# EAGLE schematic prototype (EAGLE 6.5.0)
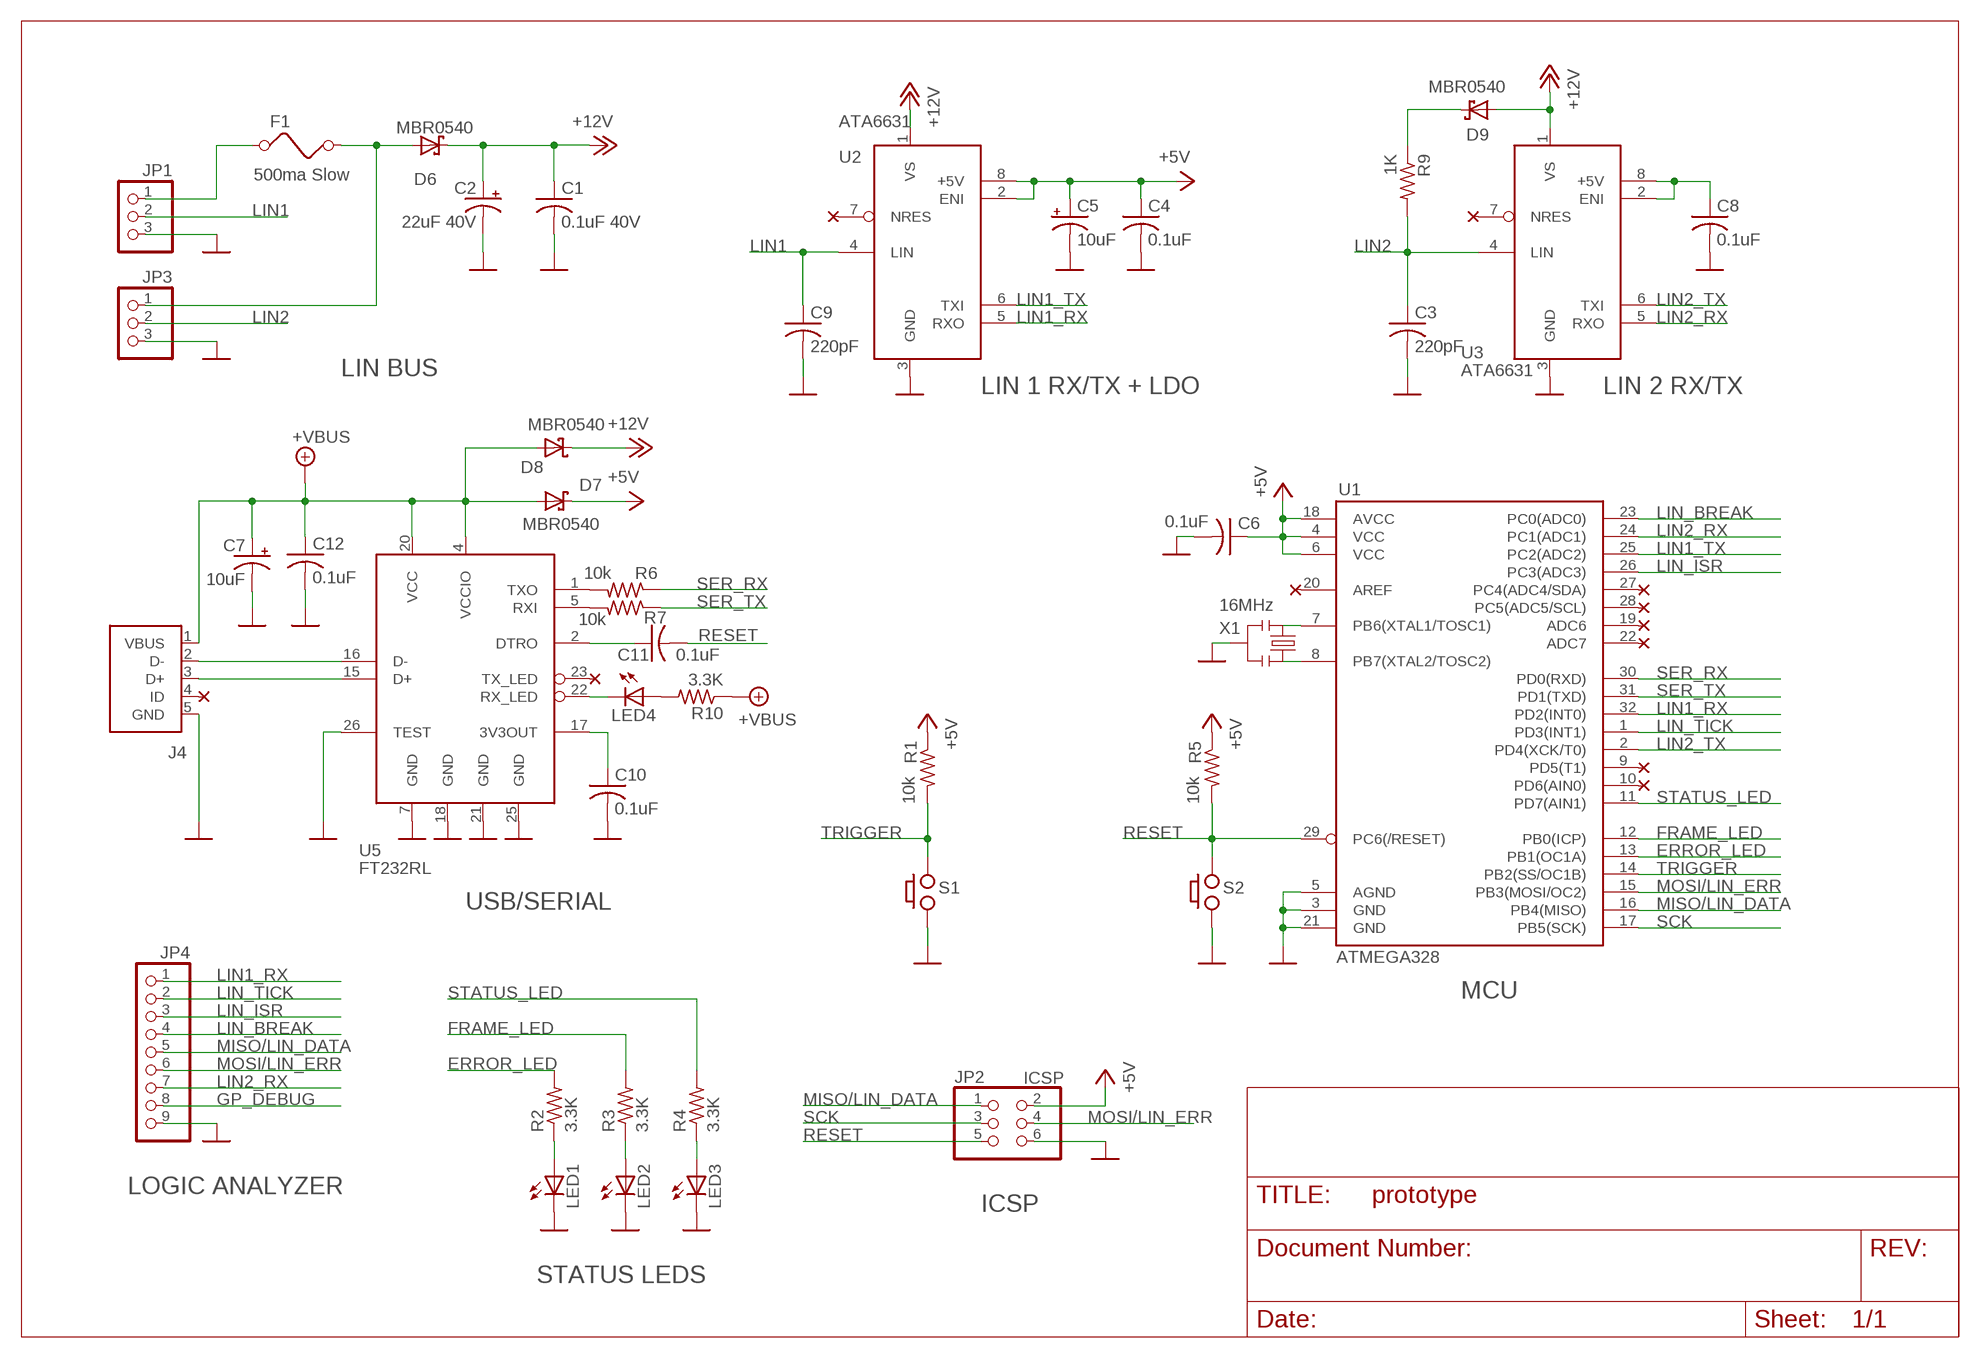
[diagram p0: schematic, sheet 1]

## Parts
C1  0.1uF 40V  C-USC0805  [C0805]
C2  22uF 40V  CPOL-USUD-6,3X5,8  [UD-6,3X5,8_NICHICON]
C3  220pF  C-USC0805  [C0805]
C4  0.1uF  C-USC0805  [C0805]
C5  10uF  CPOL-USA/3216-18R  [A/3216-18R]
C6  0.1uF  C-USC0805  [C0805]
C7  10uF  CPOL-USA/3216-18R  [A/3216-18R]
C8  0.1uF  C-USC0805  [C0805]
C9  220pF  C-USC0805  [C0805]
C10  0.1uF  C-USC0805  [C0805]
C11  0.1uF  C-USC0805  [C0805]
C12  0.1uF  C-USC0805  [C0805]
D6  MBR0540  SMF5.0AT1  [SOD123FL]
D7  MBR0540  SMF5.0AT1  [SOD123FL]
D8  MBR0540  SMF5.0AT1  [SOD123FL]
D9  MBR0540  SMF5.0AT1  [SOD123FL]
F1  500ma Slow  FUSE  [1206]
J4  USBSMD  [USB-MINIB]
JP1  PINHD-1X3  [1X03]
JP2  ICSP  PINHD-2X3  [2X03]
JP3  PINHD-1X3  [1X03]
JP4  PINHD-1X9  [1X09]
LED1  LED  [1206-LED]
LED2  LED  [1206-LED]
LED3  LED  [1206-LED]
LED4  LED  [1206-LED]
R1  10k  R-US_R0805  [R0805]
R2  3.3K  R-US_R0805  [R0805]
R3  3.3K  R-US_R0805  [R0805]
R4  3.3K  R-US_R0805  [R0805]
R5  10k  R-US_R0805  [R0805]
R6  10k  R-US_R0805  [R0805]
R7  10k  R-US_R0805  [R0805]
R9  1K  R-US_R0805  [R0805]
R10  3.3K  R-US_R0805  [R0805]
S1  PUSH_BUTTON  [DUMMY-2]
S2  PUSH_BUTTON  [DUMMY-2]
U1  ATMEGA328  [TQFP32-08]
U2  ATA6631  [SO-08]
U3  ATA6631  [SO-08]
U5  FT232RL  [SSOP28DB]
X1  16MHz  RESONATORSMD  [RESONATOR-SMD]

## Nets
+5V: C4.1 C5.+ C6.1 D7.C JP2.2 R1.1 R5.1 U1.4(VCC) U1.6(VCC) U1.18(AVCC) U2.2(ENI) U2.8(+5V)
+12V: C1.1 C2.+ D6.C D8.C D9.A U2.1(VS) U3.1(VS)
+VBUS: C7.+ C12.1 D7.A D8.A J4.1(VBUS) R10.1 U5.4(VCCIO) U5.20(VCC)
ERROR_LED: R2.2 U1.13(PB1(OC1A))
FRAME_LED: R3.2 U1.12(PB0(ICP))
GND: C1.2 C2.- C3.2 C4.2 C5.- C6.2 C7.- C8.2 C9.2 C10.2 C12.2 J4.5(GND) JP1.3 JP2.6 JP3.3 JP4.9 LED1.C LED2.C LED3.C S1.P$2 S2.P$2 U1.3(GND) U1.5(AGND) U1.21(GND) U2.3(GND) U3.3(GND) U5.7(GND) U5.18(GND) U5.21(GND) U5.25(GND) U5.26(TEST) X1.2
GP_DEBUG: JP4.8
LIN1: C9.1 JP1.2 U2.4(LIN)
LIN1_RX: JP4.1 U1.32(PD2(INT0)) U2.5(RXO)
LIN1_TX: U1.25(PC2(ADC2)) U2.6(TXI)
LIN2: C3.1 JP3.2 R9.2 U3.4(LIN)
LIN2_RX: JP4.7 U1.24(PC1(ADC1)) U3.5(RXO)
LIN2_TX: U1.2(PD4(XCK/T0)) U3.6(TXI)
LIN_BREAK: JP4.4 U1.23(PC0(ADC0))
LIN_ISR: JP4.3 U1.26(PC3(ADC3))
LIN_TICK: JP4.2 U1.1(PD3(INT1))
MISO/LIN_DATA: JP2.1 JP4.5 U1.16(PB4(MISO))
MOSI/LIN_ERR: JP2.4 JP4.6 U1.15(PB3(MOSI/OC2))
N$1: LED4.C U5.22(RX_LED)
N$2: LED3.A R4.1
N$3: LED2.A R3.1
N$4: LED1.A R2.1
N$6: D6.A F1.2 JP3.1
N$7: J4.3(D+) U5.15(D+)
N$8: J4.2(D-) U5.16(D-)
N$9: D9.C R9.1
N$12: R6.2 U5.1(TXO)
N$14: C11.1 U5.2(DTRO)
N$15: LED4.A R10.2
N$16: R7.2 U5.5(RXI)
N$22: C10.1 U5.17(3V3OUT)
RESET: C11.2 JP2.5 R5.2 S2.P$1 U1.29(PC6(/RESET))
SCK: JP2.3 U1.17(PB5(SCK))
SECONDARY_5V: C8.1 U3.2(ENI) U3.8(+5V)
SER_RX: R6.1 U1.30(PD0(RXD))
SER_TX: R7.1 U1.31(PD1(TXD))
STATUS_LED: R4.2 U1.11(PD7(AIN1))
TRIGGER: R1.2 S1.P$1 U1.14(PB2(SS/OC1B))
VBAT: F1.1 JP1.1
XTAL1: U1.7(PB6(XTAL1/TOSC1)) X1.3
XTAL2: U1.8(PB7(XTAL2/TOSC2)) X1.1
Unconnected: J4.4(ID) U1.9(PD5(T1)) U1.10(PD6(AIN0)) U1.19(ADC6) U1.20(AREF) U1.22(ADC7) U1.27(PC4(ADC4/SDA)) U1.28(PC5(ADC5/SCL)) U2.7(NRES) U3.7(NRES) U5.23(TX_LED)

## Notes on the sheet
- LIN BUS
- LIN 1 RX/TX + LDO | LIN 2 RX/TX
- USB/SERIAL
- MCU
- LOGIC ANALYZER
- ICSP
- STATUS LEDS

## Library data of the parts
C1 C3 C4 C6 C8-C12 = prototype:C-US: CAPACITOR, American symbol
C2 C5 C7 = prototype:CPOL-US
D6-D9 = prototype:SMF5.0AT1
F1 = prototype:FUSE
J4 = prototype:USB: USB Connectors USB-B-PTH is fully proven SKU : PRT-00139 USB-miniB is fully proven SKU : PRT-00587 USB-A-PCB is untested. USB-A-H is throughly reviewed, but untested. Spark Fun Electronics SKU : PRT-00437 USB-B-SMT is throughly reviewed, but untested. Needs silkscreen touching up. USB-A-S has not been used/tested USB-MB-H has not been used/tested
JP1 JP3 = prototype:PINHD-1X3: PIN HEADER
JP2 = prototype:PINHD-2X3: PIN HEADER
JP4 = prototype:PINHD-1X9: PIN HEADER
LED1-LED4 = prototype:LED
R1-R7 R9 R10 = prototype:R-US_: RESISTOR, American symbol
S1 S2 = prototype:PUSH_BUTTON
U1 = beeper:ATMEGA328
U2 U3 = prototype:ATA6631
U5 = prototype:FT232RL
X1 = prototype:RESONATOR

## Net classes
1 vcc: width 0.254 mm